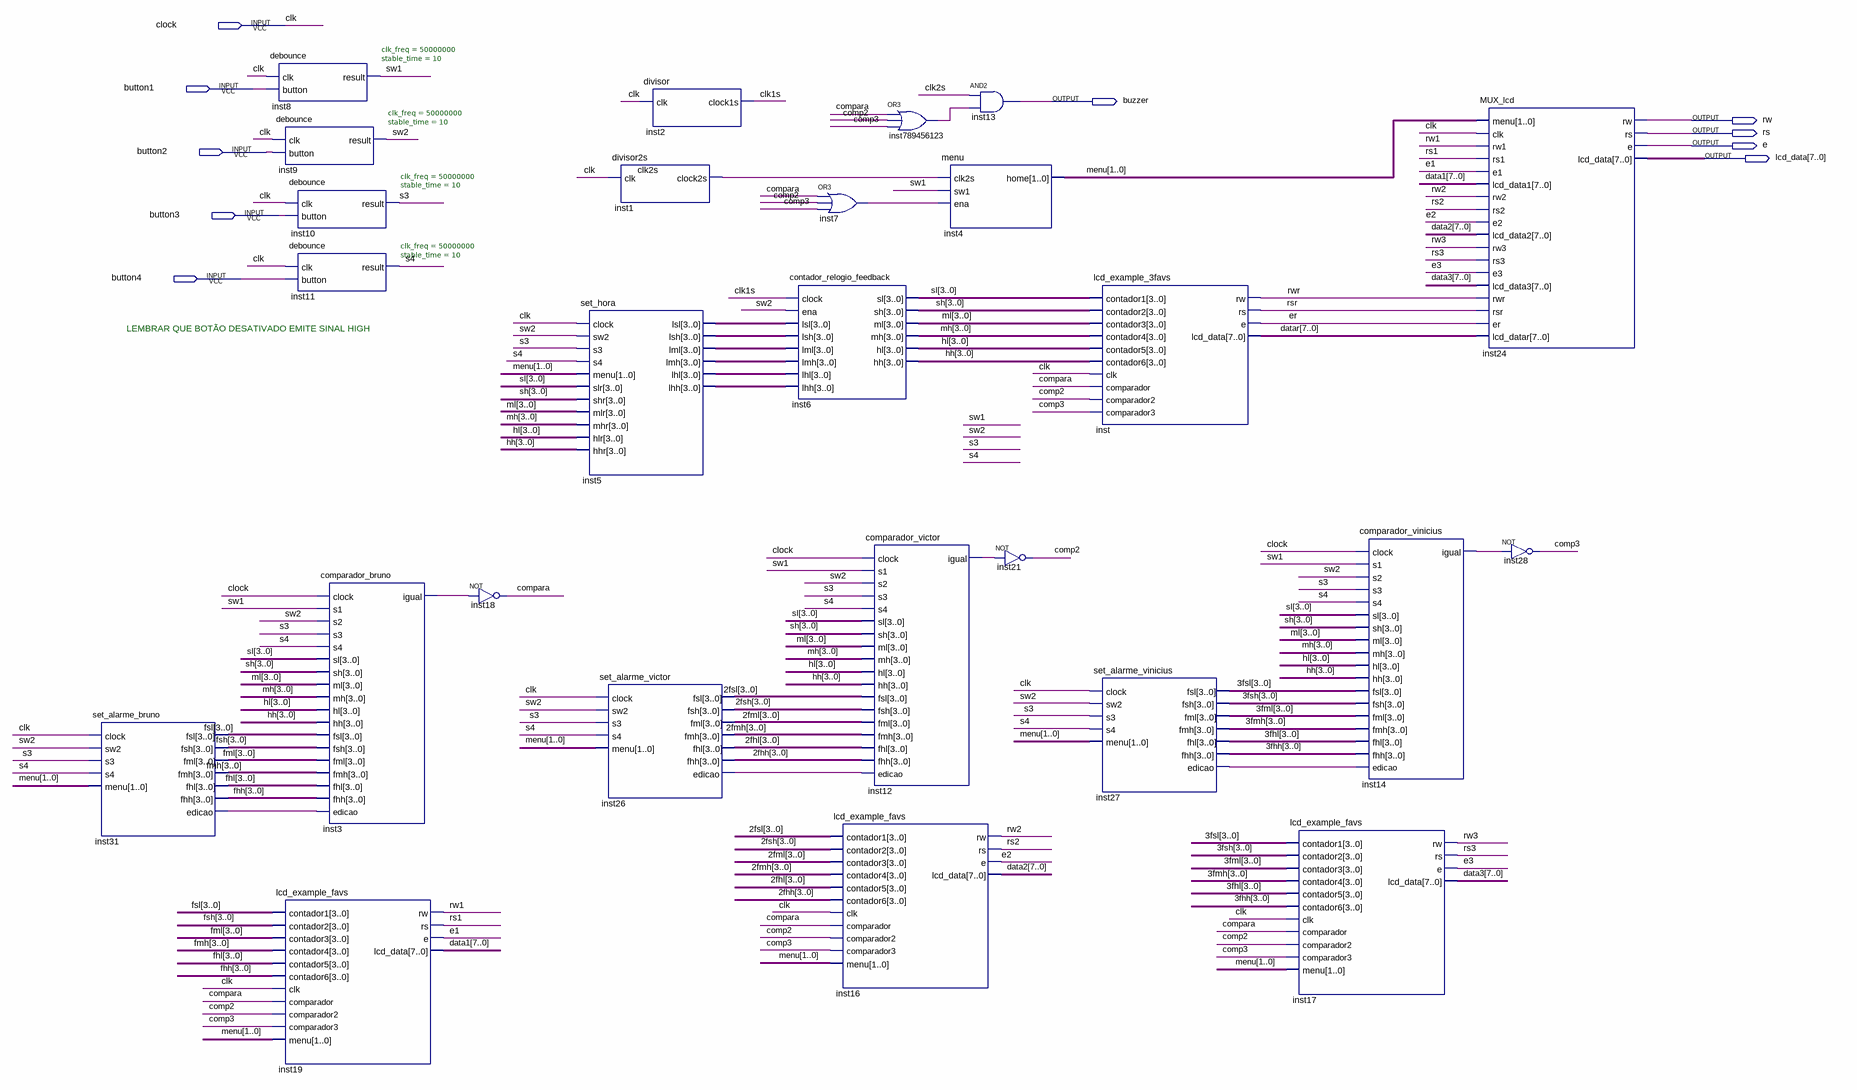
[diagram p0: schematic sheet]
// Quartus schematic testecontdisp.bdf as structural Verilog: 26 symbols, 10 pins
module testecontdisp (
  input  clock,
  input  button1,
  input  button2,
  input  button3,
  input  button4,
  output buzzer,
  output rw,
  output rs,
  output e,
  output [7:0] lcd_data
);

  wire clk1s, clk2s, comp2, comp3, compara, e1, e2, e3, er, inst3_igual, inst7_out, inst12_igual,
       inst14_igual, inst26_edicao, inst27_edicao, inst31_edicao, inst789456123_out, rs1, rs2, rs3, rsr, rw1,
       rw2, rw3, rwr, s3, s4, sw1, sw2;
  wire [1:0] menu;
  wire [3:0] \2fhh , \2fhl , \2fmh , \2fml , \2fsh , \2fsl , \3fhh , \3fhl , \3fmh , \3fml , \3fsh , \3fsl ,
       fhh, fhl, fmh, fml, fsh, fsl, hh, hl, inst5_lhh, inst5_lhl, inst5_lmh, inst5_lml, inst5_lsh,
       inst5_lsl, mh, ml, sh, sl;
  wire [7:0] data1, data2, data3, datar;

  set_alarme_bruno inst31 (
    .clock(clock), .sw2(sw2), .s3(s3), .s4(s4), .menu(menu), .fsl(fsl), .fsh(fsh), .fml(fml), .fmh(fmh),
    .fhl(fhl), .fhh(fhh), .edicao(inst31_edicao));
  debounce #(.clk_freq(50000000), .stable_time(10)) inst8 (.clk(clock), .button(button1), .result(sw1));
  debounce #(.clk_freq(50000000), .stable_time(10)) inst9 (.clk(clock), .button(button2), .result(sw2));
  debounce #(.clk_freq(50000000), .stable_time(10)) inst10 (.clk(clock), .button(button3), .result(s3));
  debounce #(.clk_freq(50000000), .stable_time(10)) inst11 (.clk(clock), .button(button4), .result(s4));
  lcd_example_favs inst19 (
    .contador1(fsl), .contador2(fsh), .contador3(fml), .contador4(fmh), .contador5(fhl), .contador6(fhh),
    .clk(clock), .comparador(compara), .comparador2(comp2), .comparador3(comp3), .menu(menu), .rw(rw1),
    .rs(rs1), .e(e1), .lcd_data(data1));
  comparador_bruno inst3 (
    .clock(clock), .s1(sw1), .s2(sw2), .s3(s3), .s4(s4), .sl(sl), .sh(sh), .ml(ml), .mh(mh), .hl(hl),
    .hh(hh), .fsl(fsl), .fsh(fsh), .fml(fml), .fmh(fmh), .fhl(fhl), .fhh(fhh), .edicao(inst31_edicao),
    .igual(inst3_igual));
  not inst18 (compara, inst3_igual);
  set_hora inst5 (
    .clock(clock), .sw2(sw2), .s3(s3), .s4(s4), .menu(menu), .slr(sl), .shr(sh), .mlr(ml), .mhr(mh),
    .hlr(hl), .hhr(hh), .lsl(inst5_lsl), .lsh(inst5_lsh), .lml(inst5_lml), .lmh(inst5_lmh), .lhl(inst5_lhl),
    .lhh(inst5_lhh));
  divisor inst2 (.clk(clock), .clock1s(clk1s));
  divisor2s inst1 (.clk(clock), .clock2s(clk2s));
  set_alarme_victor inst26 (
    .clock(clock), .sw2(sw2), .s3(s3), .s4(s4), .menu(menu), .fsl(\2fsl ), .fsh(\2fsh ), .fml(\2fml ),
    .fmh(\2fmh ), .fhl(\2fhl ), .fhh(\2fhh ), .edicao(inst26_edicao));
  contador_relogio_feedback inst6 (
    .clock(clk1s), .ena(sw2), .lsl(inst5_lsl), .lsh(inst5_lsh), .lml(inst5_lml), .lmh(inst5_lmh),
    .lhl(inst5_lhl), .lhh(inst5_lhh), .sl(sl), .sh(sh), .ml(ml), .mh(mh), .hl(hl), .hh(hh));
  or inst7 (inst7_out, compara, comp2, comp3);
  lcd_example_favs inst16 (
    .contador1(\2fsl ), .contador2(\2fsh ), .contador3(\2fml ), .contador4(\2fmh ), .contador5(\2fhl ),
    .contador6(\2fhh ), .clk(clock), .comparador(compara), .comparador2(comp2), .comparador3(comp3),
    .menu(menu), .rw(rw2), .rs(rs2), .e(e2), .lcd_data(data2));
  or inst789456123 (inst789456123_out, compara, comp2, comp3);
  comparador_victor inst12 (
    .clock(clock), .s1(sw1), .s2(sw2), .s3(s3), .s4(s4), .sl(sl), .sh(sh), .ml(ml), .mh(mh), .hl(hl),
    .hh(hh), .fsl(\2fsl ), .fsh(\2fsh ), .fml(\2fml ), .fmh(\2fmh ), .fhl(\2fhl ), .fhh(\2fhh ),
    .edicao(inst26_edicao), .igual(inst12_igual));
  menu inst4 (.clk2s(clk2s), .sw1(sw1), .ena(inst7_out), .home(menu));
  and inst13 (buzzer, clk2s, inst789456123_out);
  not inst21 (comp2, inst12_igual);
  lcd_example_3favs inst (
    .contador1(sl), .contador2(sh), .contador3(ml), .contador4(mh), .contador5(hl), .contador6(hh),
    .clk(clock), .comparador(compara), .comparador2(comp2), .comparador3(comp3), .rw(rwr), .rs(rsr), .e(er),
    .lcd_data(datar));
  set_alarme_vinicius inst27 (
    .clock(clock), .sw2(sw2), .s3(s3), .s4(s4), .menu(menu), .fsl(\3fsl ), .fsh(\3fsh ), .fml(\3fml ),
    .fmh(\3fmh ), .fhl(\3fhl ), .fhh(\3fhh ), .edicao(inst27_edicao));
  lcd_example_favs inst17 (
    .contador1(\3fsl ), .contador2(\3fsh ), .contador3(\3fml ), .contador4(\3fmh ), .contador5(\3fhl ),
    .contador6(\3fhh ), .clk(clock), .comparador(compara), .comparador2(comp2), .comparador3(comp3),
    .menu(menu), .rw(rw3), .rs(rs3), .e(e3), .lcd_data(data3));
  comparador_vinicius inst14 (
    .clock(clock), .s1(sw1), .s2(sw2), .s3(s3), .s4(s4), .sl(sl), .sh(sh), .ml(ml), .mh(mh), .hl(hl),
    .hh(hh), .fsl(\3fsl ), .fsh(\3fsh ), .fml(\3fml ), .fmh(\3fmh ), .fhl(\3fhl ), .fhh(\3fhh ),
    .edicao(inst27_edicao), .igual(inst14_igual));
  MUX_lcd inst24 (
    .menu(menu), .clk(clock), .rw1(rw1), .rs1(rs1), .e1(e1), .lcd_data1(data1), .rw2(rw2), .rs2(rs2),
    .e2(e2), .lcd_data2(data2), .rw3(rw3), .rs3(rs3), .e3(e3), .lcd_data3(data3), .rwr(rwr), .rsr(rsr),
    .er(er), .lcd_datar(datar), .rw(rw), .rs(rs), .e(e), .lcd_data(lcd_data));
  not inst28 (comp3, inst14_igual);

  // Other names for the same wires on the sheet: clk = clock

  // Notes on the sheet:
  //   LEMBRAR QUE BOTÃO DESATIVADO EMITE SINAL HIGH
endmodule
